# EAGLE design MKR-I2C-shield (EAGLE 9.2.2)
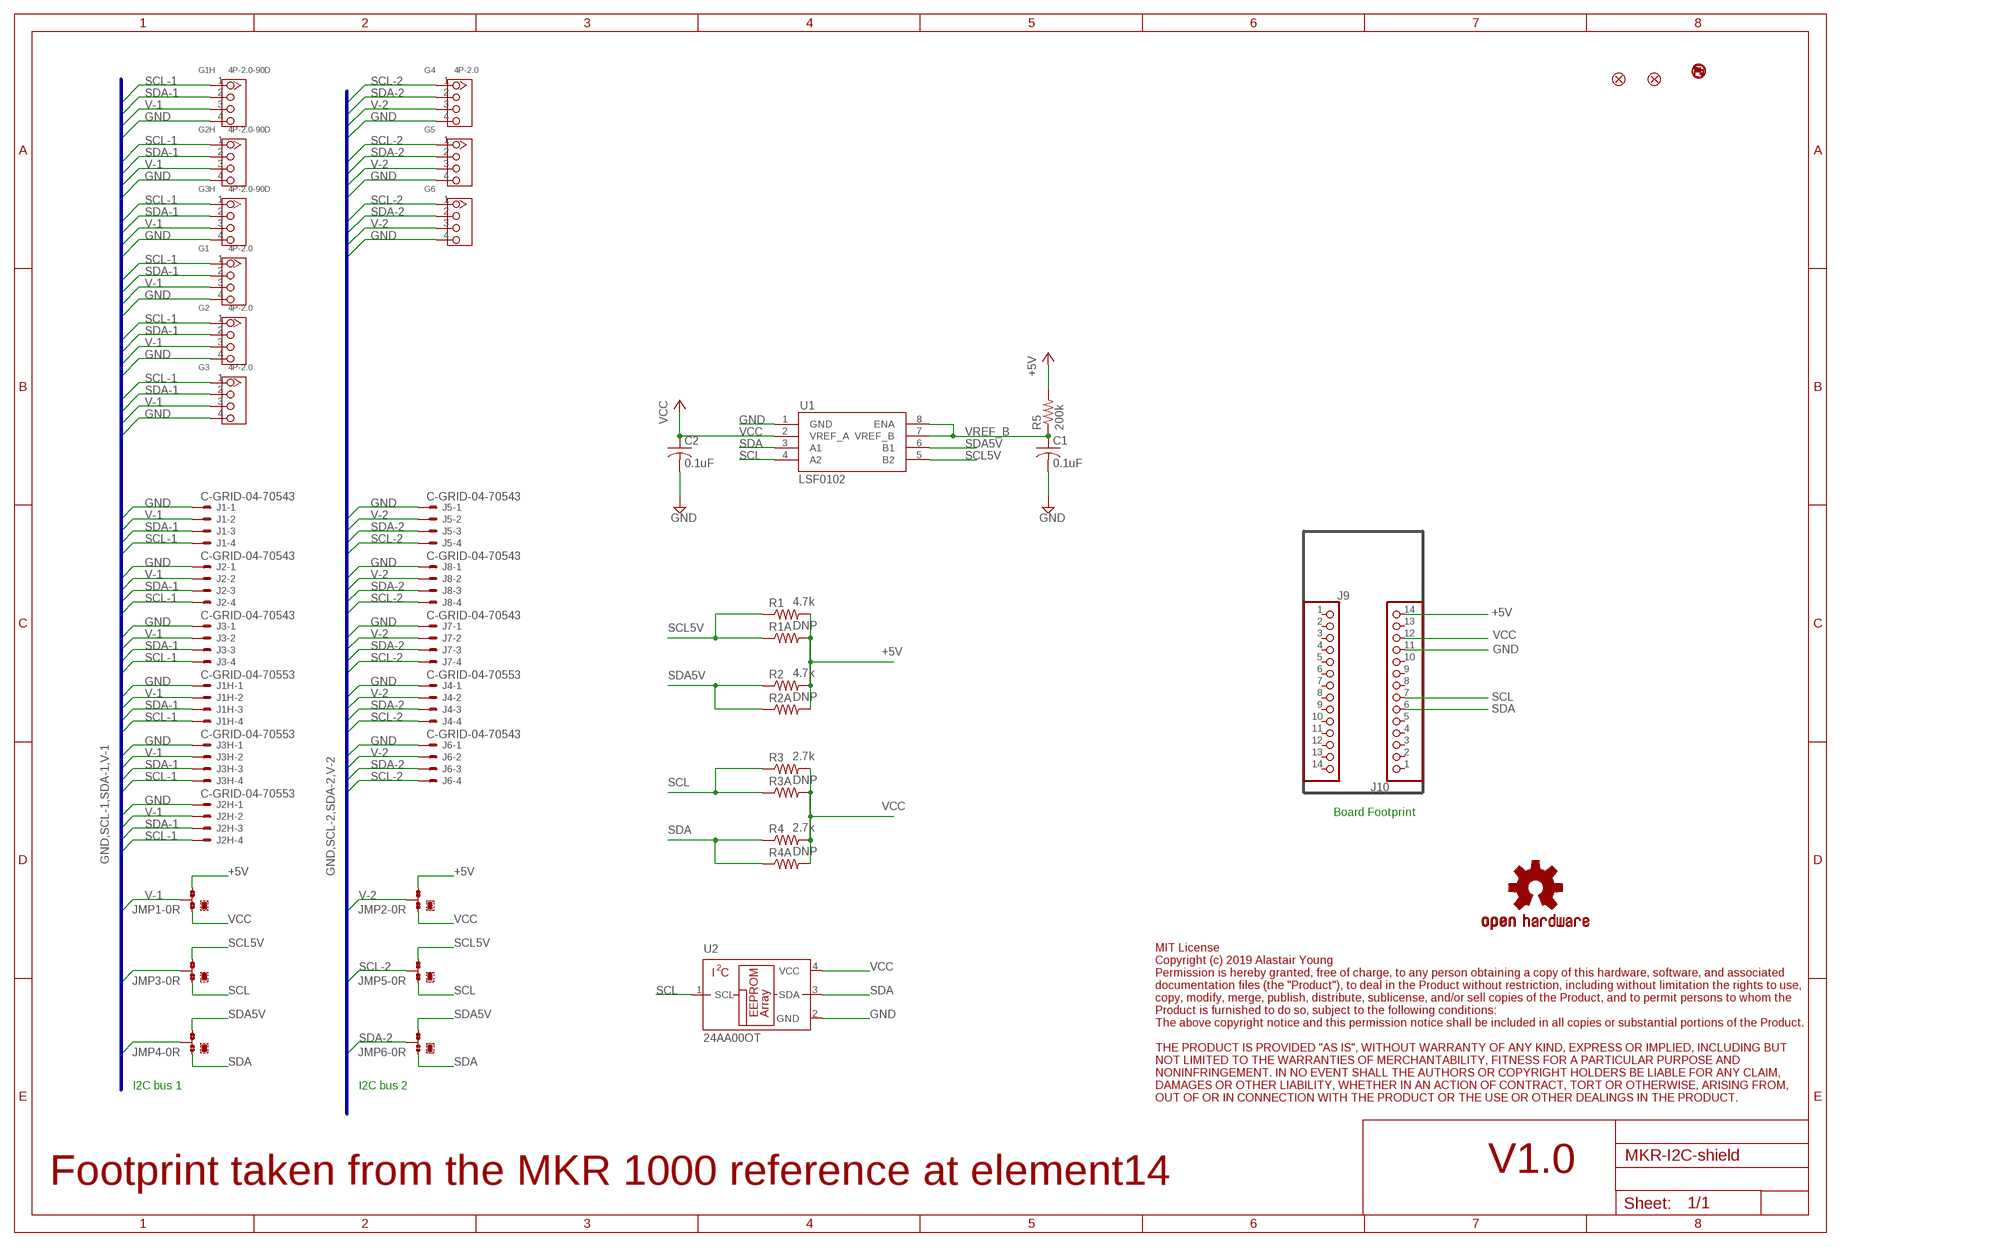
[diagram p0: schematic, sheet 1]

## Parts
C1  0.1uF  C-USC0603  [C0603]
C2  0.1uF  C-USC0603  [C0603]
FD1  FIDUCIAL1X2  [FIDUCIAL-1X2]
FD2  FIDUCIAL1X2  [FIDUCIAL-1X2]
G1  4P-2.0  GROVE-CONNECTOR-DIP(4P-2.0)  [HW4-2.0]
G1H  4P-2.0-90D  GROVE-CONNECTOR-DIP-90D(4P-2.0)  [HW4-2.0-90D]
G2  4P-2.0  GROVE-CONNECTOR-DIP(4P-2.0)  [HW4-2.0]
G2H  4P-2.0-90D  GROVE-CONNECTOR-DIP-90D(4P-2.0)  [HW4-2.0-90D]
G3  4P-2.0  GROVE-CONNECTOR-DIP(4P-2.0)  [HW4-2.0]
G3H  4P-2.0-90D  GROVE-CONNECTOR-DIP-90D(4P-2.0)  [HW4-2.0-90D]
G4  4P-2.0  GROVE-CONNECTOR-DIP(4P-2.0)  [HW4-2.0]
G5  4P-2.0  GROVE-CONNECTOR-DIP(4P-2.0)  [HW4-2.0]
G6  4P-2.0  GROVE-CONNECTOR-DIP(4P-2.0)  [HW4-2.0]
J1  C-GRID-04-70543  [70543-04]
J1H  C-GRID-04-70553  [70553-04]
J2  C-GRID-04-70543  [70543-04]
J2H  C-GRID-04-70553  [70553-04]
J3  C-GRID-04-70543  [70543-04]
J3H  C-GRID-04-70553  [70553-04]
J4  C-GRID-04-70553  [70553-04]
J5  C-GRID-04-70543  [70543-04]
J6  C-GRID-04-70543  [70543-04]
J7  C-GRID-04-70543  [70543-04]
J8  C-GRID-04-70543  [70543-04]
J9  DNP  PINHD-1X14  [1X14]
J10  DNP  PINHD-1X14  [1X14]
JMP1  0R-JUMPB  [B0R-JMP]
JMP2  0R-JUMPB  [B0R-JMP]
JMP3  0R-JUMPB  [B0R-JMP]
JMP4  0R-JUMPB  [B0R-JMP]
JMP5  0R-JUMPB  [B0R-JMP]
JMP6  0R-JUMPB  [B0R-JMP]
LOGO1  OSHW-LOGOL  [OSHW-LOGO-L]
LOGO2  NO_PB_LOGO  [NO_PB_LOGO_0.120]
R1  4.7k  R-US_R0603  [R0603]
R1A  DNP  R-US_0204/5  [0204/5]
R2  4.7k  R-US_R0603  [R0603]
R2A  DNP  R-US_0204/5  [0204/5]
R3  2.7k  R-US_R0603  [R0603]
R3A  DNP  R-US_0204/5  [0204/5]
R4  2.7k  R-US_R0603  [R0603]
R4A  DNP  R-US_0204/5  [0204/5]
R5  200k  R-US_R0603  [R0603]
U1  LSF0102  [DCT_R-PDSO-G8]
U2  24AA00OT  [SOT23-5L]

## Nets
+5V: J10.14 JMP1.3 JMP2.3 R1.2 R1A.2 R2.2 R2A.2 R5.2
GND: C1.2 C2.2 G1.4 G1H.4 G2.4 G2H.4 G3.4 G3H.4 G4.4 G5.4 G6.4 J1.1 J1H.1 J2.1 J2H.1 J3.1 J3H.1 J4.1 J5.1 J6.1 J7.1 J8.1 J10.11 U1.1(GND) U2.2(GND)
SCL: J10.7 JMP3.1 JMP5.1 R3.1 R3A.1 U1.4(A2) U2.1(SCL)
SCL5V: JMP3.3 JMP5.3 R1.1 R1A.1 U1.5(B2)
SCL-1: G1.1 G1H.1 G2.1 G2H.1 G3.1 G3H.1 J1.4 J1H.4 J2.4 J2H.4 J3.4 J3H.4 JMP3.2
SCL-2: G4.1 G5.1 G6.1 J4.4 J5.4 J6.4 J7.4 J8.4 JMP5.2
SDA: J10.6 JMP4.1 JMP6.1 R4.1 R4A.1 U1.3(A1) U2.3(SDA)
SDA5V: JMP4.3 JMP6.3 R2.1 R2A.1 U1.6(B1)
SDA-1: G1.2 G1H.2 G2.2 G2H.2 G3.2 G3H.2 J1.3 J1H.3 J2.3 J2H.3 J3.3 J3H.3 JMP4.2
SDA-2: G4.2 G5.2 G6.2 J4.3 J5.3 J6.3 J7.3 J8.3 JMP6.2
V-1: G1.3 G1H.3 G2.3 G2H.3 G3.3 G3H.3 J1.2 J1H.2 J2.2 J2H.2 J3.2 J3H.2 JMP1.2
V-2: G4.3 G5.3 G6.3 J4.2 J5.2 J6.2 J7.2 J8.2 JMP2.2
VCC: C2.1 J10.12 JMP1.1 JMP2.1 R3.2 R3A.2 R4.2 R4A.2 U1.2(VREF_A) U2.4(VCC)
VREF_B: C1.1 R5.1 U1.7(VREF_B) U1.8(ENA)
Unconnected: J9.1 J9.2 J9.3 J9.4 J9.5 J9.6 J9.7 J9.8 J9.9 J9.10 J9.11 J9.12 J9.13 J9.14 J10.1 J10.2 J10.3 J10.4 J10.5 J10.8 J10.9 J10.10 J10.13

## Buses
GND,SCL-1,SDA-1,V-1
GND,SCL-2,SDA-2,V-2

## Notes on the sheet
- Board Footprint
- I2C bus 1 | I2C bus 2
- MIT License
  Copyright (c) 2019 Alastair Young
  Permission is hereby granted, free of charge, to any person obtaining a copy of this hardware, software, and associated
  documentation files (the "Product"), to deal in the Product without restriction, including without limitation the rights to use,
  copy, modify, merge, publish, distribute, sublicense, and/or sell copies of the Product, and to permit persons to whom the
  Product is furnished to do so, subject to the following conditions:
  The above copyright notice and this permission notice shall be included in all copies or substantial portions of the Product.
  
  THE PRODUCT IS PROVIDED "AS IS", WITHOUT WARRANTY OF ANY KIND, EXPRESS OR IMPLIED, INCLUDING BUT
  NOT LIMITED TO THE WARRANTIES OF MERCHANTABILITY, FITNESS FOR A PARTICULAR PURPOSE AND
  NONINFRINGEMENT. IN NO EVENT SHALL THE AUTHORS OR COPYRIGHT HOLDERS BE LIABLE FOR ANY CLAIM,
  DAMAGES OR OTHER LIABILITY, WHETHER IN AN ACTION OF CONTRACT, TORT OR OTHERWISE, ARISING FROM,
  OUT OF OR IN CONNECTION WITH THE PRODUCT OR THE USE OR OTHER DEALINGS IN THE PRODUCT.
- Footprint taken from the MKR 1000 reference at element14 | V1.0

## Library data of the parts
C1 C2 = rcl:C-US: CAPACITOR, American symbol; SPICEPREFIX: C
FD1 FD2 = SparkFun-Aesthetics:FIDUCIAL: Fiducial Alignment Points Point-of-reference for pick-and-place machines and other optical instruments.
G1-G6 = redhunter:GROVE-CONNECTOR-DIP(4P-2.0): 320110033
G1H G2H G3H = redhunter:GROVE-CONNECTOR-DIP-90D(4P-2.0): 320110034
J1 J1H J2 J2H J3 J3H J4-J8 = redhunter:C-GRID-04: CONNECTOR wire to board 2.54 mm (0.100") pitch header; MF: MOLEX; OC_FARNELL: unknown; OC_NEWARK: unknown
J9 J10 = adafruit:PINHD-1X14: PIN HEADER
JMP1-JMP6 = redhunter:0R-JUMP: SMD 0R 0805 Jumper
LOGO1 = SparkFun-Aesthetics:OSHW-LOGO: Open-Source Hardware (OSHW) Logo This logo indicates the piece of hardware it is found on incorporates a OSHW license and/or adheres to the definition of open source hardware found here: http://freedomdefined.org/OSHW
LOGO2 = SparkFun-Aesthetics:NO_PB_LOGO: Lead-Free (No Pb) Logo Logo for lead-safe certified hardware.
R1 R1A R2 R2A R3 R3A R4 R4A R5 = rcl:R-US_: RESISTOR, American symbol; SPICEPREFIX: R
U1 = redhunter:LSF0102
U2 = microchip:24*00: Serial EEPROM 128 bit, I2C (AA = 1.8 V/LC = 2.5 V/C = 5.0 V); MF: MICROCHIP; MPN: 24AA00T-I/OTG; OC_FARNELL: 1331264; OC_NEWARK: 89H3038

## Net classes
0 default: width 0.203 mm, drill 0.33 mm, clearance 0.203 mm
1 power: width 0.254 mm, drill 0.406 mm, clearance 0.254 mm

## Board
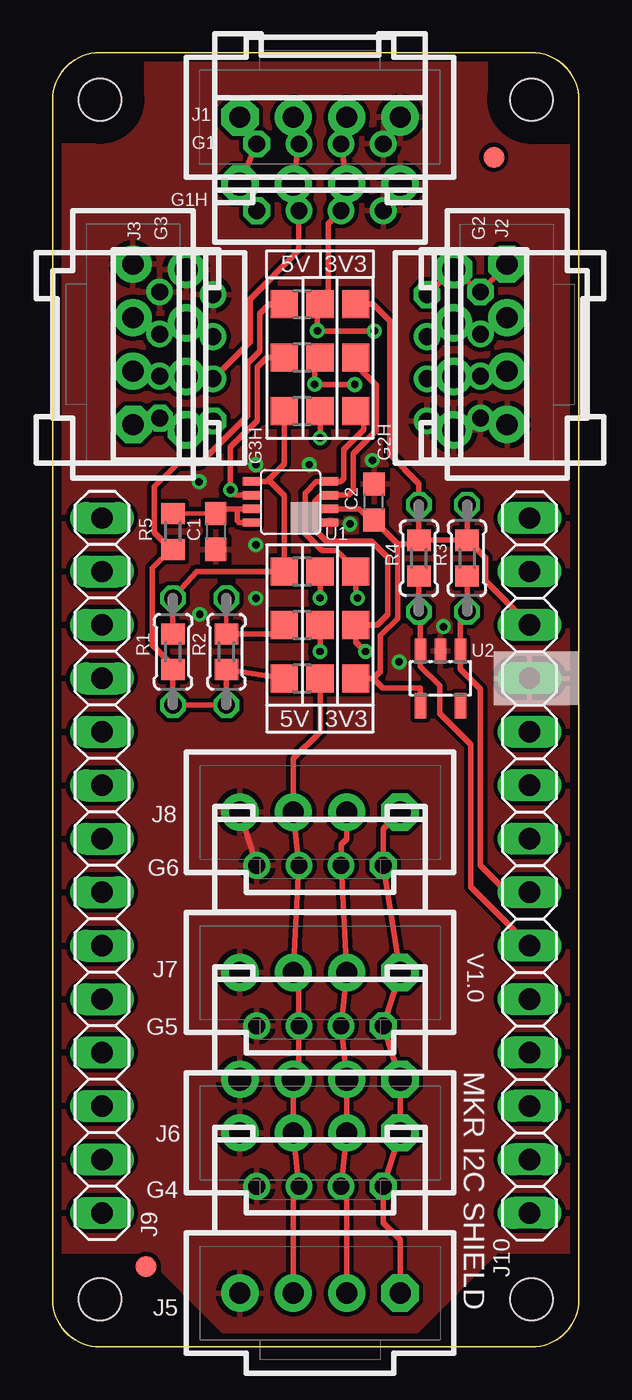
[diagram p1: board, top side]
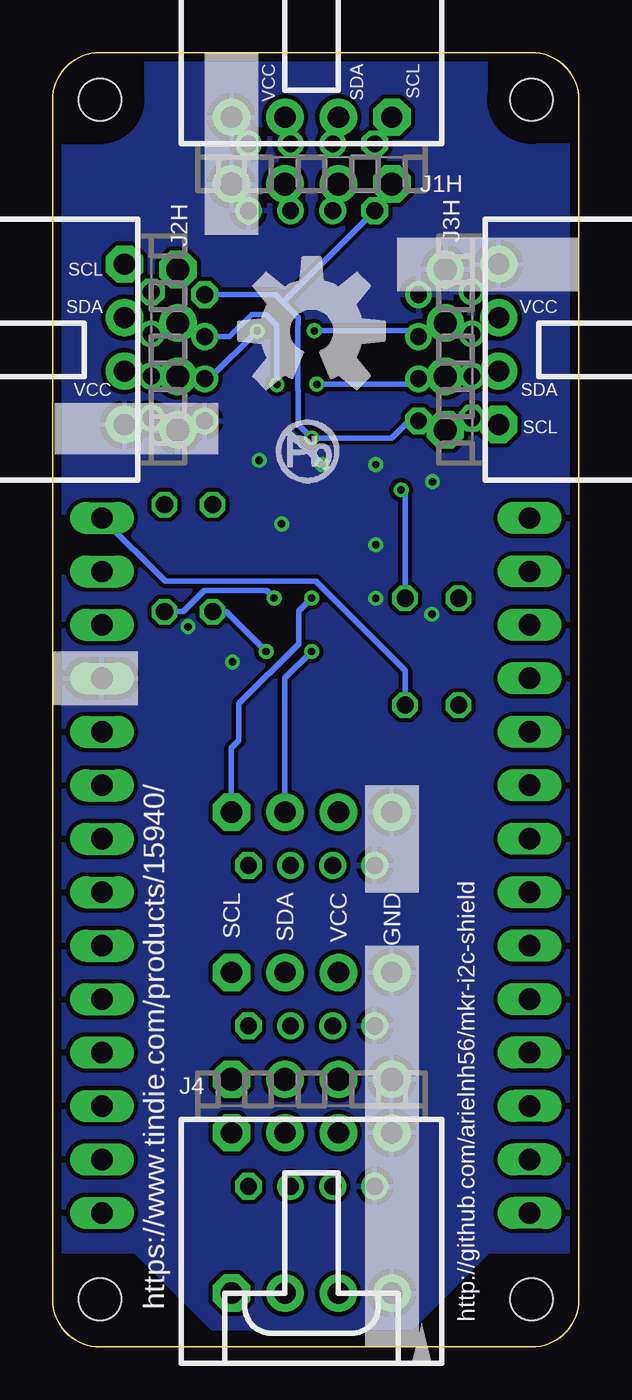
[diagram p2: board, bottom side, seen from below]

Size 25 x 61.5 mm. Coordinates in mm from the lower left corner, seen from the top.
Outline: 0,2.25 0,59.25 arc-90 2.25,61.5 22.75,61.5 arc-90 25,59.25 25,2.25 arc-90 22.75,0 2.25,0 arc-90 0,2.25
Copper layers (1*16): Top 0.0356mm / dielectric 1.5011mm / Bottom 0.0356mm
Design rules "mypcbway": minimum track width 6mil, minimum drill 13mil, track to track 6mil, track to pad 6mil, pad to pad 6mil, via to via 6mil, smd to smd 6mil, copper to edge 15mil, drill to drill 6mil, minimum pad ring 7mil, minimum via ring 7mil, stop-mask expansion 2.5mil, vias tented up to drill 24mil, thermal gap 10mil
Holes 2 mm at 2.25,59.26 22.75,59.26 22.75,2.26 2.25,2.26
tRestrict: area 0.3,57.3 to 4.2,61.2; area 20.8,57.3 to 24.7,61.2; 4 lines
bRestrict: area 0.3,57.3 to 4.2,61.2; area 20.8,57.3 to 24.7,61.2; 4 lines

### Footprints (pad centres in the part's own frame; a part is rotated, then mirrored left to right if it is on the bottom)
C0603 = smd 1.1 x 1: 1 -0.85,0; 2 0.85,0
FIDUCIAL-1X2 = smd 1 x 1: 1 0,0
HW4-2.0 = drill 0.8 pad 1.27 octagon: 1 -3,0 | drill 0.8 pad 1.27: 2 -1,0; 3 1,0; 4 3,0
HW4-2.0-90D = drill 0.8 pad 1.27 octagon: 1 -3,0 | drill 0.8 pad 1.27: 2 -1,0; 3 1,0; 4 3,0
70543-04 = drill 1.016 pad 1.778: 1 -3.81,0; 2 -1.27,0; 3 1.27,0 | drill 1.016 pad 1.778 octagon: 4 3.81,0
70553-04 = drill 1.092 pad 1.778: 1 -3.81,0; 2 -1.27,0; 3 1.27,0 | drill 1.092 pad 1.778 octagon: 4 3.81,0
1X14 = drill 1.016 long: 1 -16.51,0; 2 -13.97,0; 3 -11.43,0; 4 -8.89,0; 5 -6.35,0; 6 -3.81,0; 7 -1.27,0; 8 1.27,0; 9 3.81,0; 10 6.35,0; 11 8.89,0; 12 11.43,0; 13 13.97,0; 14 16.51,0
B0R-JMP = smd 1.321 x 1.3: 1 0,1.7; 2 0,0; 3 0,-1.7
R0603 = smd 1 x 1.1: 1 -0.85,0; 2 0.85,0
0204/5 = drill 0.813 octagon: 1 -2.54,0; 2 2.54,0
DCT_R-PDSO-G8 = smd 0.4 x 0.8: 1 -0.975,-1.875; 2 -0.325,-1.875; 3 0.325,-1.875; 4 0.975,-1.875; 5 0.975,1.875; 6 0.325,1.875; 7 -0.325,1.875; 8 -0.975,1.875
SOT23-5L = smd 0.55 x 1.2: 1 -0.95,-1.3; 2 0,-1.3; 3 0.95,-1.3; 4 0.95,1.3; 5 -0.95,1.3

### Placement (x,y rotation side)
C1  7.75,38.75 270 top
C2  15.27,40.14 90 top
FD1  4.45,3.82 0 top
FD2  20.95,56.53 0 top
G1  12.7,57.16 0 top
G1H  12.7,53.99 0 top
G2  20.32,47.13 270 top
G2H  17.78,47 270 top
G3  5.08,47.13 90 top
G3H  7.62,47 90 top
G4  12.7,7.63 180 top
G5  12.7,15.25 180 top
G6  12.7,22.87 180 top
J1  12.7,58.43 180 top
J1H  12.7,55.26 0 bottom
J2  21.59,47.64 90 top
J2H  19.05,47.38 90 bottom
J3  3.81,47.64 270 top
J3H  6.35,47.38 270 bottom
J4  12.7,12.71 180 bottom
J5  12.7,2.55 0 top
J6  12.7,10.17 0 top
J7  12.7,17.79 0 top
J8  12.7,25.41 0 top
J9  2.34,22.87 270 top
J10  22.66,22.87 90 top
JMP1  12.7,49.54 270 top
JMP2  12.7,31.76 270 top
JMP3  12.7,44.46 270 top
JMP4  12.7,47 270 top
JMP5  12.7,36.84 270 top
JMP6  12.7,34.3 270 top
LOGO1  12.7,48.27 0 bottom
LOGO2  14.61,40.65 0 bottom
R1  5.71,33.03 270 top
R1A  5.71,33.03 270 top
R2  8.26,33.03 270 top
R2A  8.26,33.03 270 top
R3  19.68,37.48 90 top
R3A  19.68,37.48 90 top
R4  17.4,37.48 90 top
R4A  17.4,37.48 90 top
R5  5.71,38.75 270 top
U1  11.3,40.14 90 top
U2  18.41,31.76 180 top

### Tracks (layer width: path | path; a pad name or v marks a point on that pad's centre or on a via)
+5V
  Top 0.254: JMP2.3 R2.2 R2A.2 R1A.2 R1.2 5.71,32.37 4.72,33.36 4.72,37 5.62,37.9 R5.2 5.64,37.9 4.83,38.71 4.83,40.87 5.94,41.97 6.98,41.97 9.26,44.25 9.26,46.75 9.84,47.33 9.84,49.09 10.29,49.54 JMP1.3
  Bottom 0.254: R2A.2 8.26,32.14 12.5,36.38 19.66,36.38 J10.14
GND  (via drill 0.35)
  Top 0.254: G6.4 J8.1
  other vias: 9.65,35.57 6.99,34.81 14.12,39.1 15.19,42.13 9.65,38.11 18.57,34.23 12.19,41.92 9.65,41.92 6.96,41.11 16.46,32.55
  pour Bottom: -0.4,62.06 25.6,62.06 25.6,40.56 25.36,40.56 25.36,4.56 21.06,4.56 17.4,0.9 8,0.9 4.34,4.56 -0.4,4.56
  pour Top: -0.4,62.06 25.6,62.06 25.6,4.56 21.06,4.56 17.27,0.77 8.13,0.77 4.34,4.56 -0.4,4.56
SCL  (via drill 0.35)
  Top 0.254: R3.1 R3A.1 19.36,34.62 U2.1 19.36,32.21 20.32,31.25 20.32,22.87 21.59,21.6 J10.7 | v14.48,35.58 14.4,36.06 JMP5.1 14.4,36.92 13.49,37.83 12.8,37.83 11.99,38.64 11.99,40.58 12.53,41.12 U1.4 13.68,41.12 13.83,41.27 13.83,42.63 14.78,43.59 14.78,44.08 JMP3.1
  Bottom 0.254: R3A.1 18.8,34.94 17.81,35.93 14.82,35.93 v14.48,35.58
SCL5V
  Top 0.254: R1.1 R1A.1 6.85,36.84 JMP5.3 11,40.45 10.33,41.12 10.16,41.12 | 10.16,41.12 U1.5 | 10.16,41.12 11,41.96 JMP3.3
SCL-1  (via drill 0.35)
  Top 0.254: J2.4 G2.1 J2H.4 G2H.1 | J3.4 G3.1 J3H.4 G3H.1 | v12.7,43.19 JMP3.2 | J1.4 8.89,57.97 G1.1 J1H.4 8.89,54.8 G1H.1
  Bottom 0.254: G3H.1 8.08,44 8.89,43.19 v12.7,43.19 13.34,43.83 13.34,45.45 13.36,45.47 13.36,48.55 13.34,48.58 13.34,48.91 13.97,49.54 | G2H.1 14.43,50 13.97,49.54 | G1H.1 13.97,49.72 13.97,49.54
SCL-2  (via drill 0.35)
  Top 0.254: J5.4 16.51,5.09 15.7,5.9 G4.1 J6.4 J4.4 G5.1 J7.4 G6.1 15.7,24.6 J8.4 | JMP5.2 v12.7,35.58
  Bottom 0.254: J8.4 16.51,28.46 16.15,28.81 16.15,30.56 13.31,33.41 13.31,34.97 v12.7,35.58
SDA  (via drill 0.35)
  Top 0.254: R4.1 R4A.1 17.46,34.87 U2.3 17.46,32.33 18.38,31.42 18.38,30.11 19.86,28.62 19.86,21.86 J10.6 | v14.86,33.04 14.4,33.5 JMP6.1 15.42,34.3 15.93,34.81 15.93,37.5 15.14,38.29 12.99,38.29 12.45,38.83 12.45,40.16 12.76,40.47 U1.3 14.04,40.47 14.28,40.71 14.28,42.44 15.38,43.54 15.38,45.7 14.4,46.69 JMP4.1
  Bottom 0.254: v14.86,33.04 16.75,34.94 R4A.1
SDA5V  (via drill 0.35)
  Top 0.203: R2.1 R2A.1
  Top 0.254: JMP4.3 10.16,47 9.72,46.56 9.72,44.02 8.45,42.75 v8.45,40.73 8.71,40.47 U1.6 | R2.1 10.58,33.88 JMP6.3
  Bottom 0.254: R2A.1 8.26,40.54 v8.45,40.73
SDA-1  (via drill 0.35)
  Top 0.254: J2.3 G2.2 J2H.3 G2H.2 | J3.3 G3.2 J3H.3 G3H.2 9.38,47.76 9.38,49.79 11.7,52.11 G1H.2 J1H.3 G1.2 J1.3 | v14.35,45.73 v12.46,45.73 v12.45,45.74 12.45,47 JMP4.2
  Bottom 0.254: v12.45,45.74 7.88,45.74 G3H.2 | G2H.2 16.61,48 15.55,49.06 14.88,49.06 14.35,48.53 v14.35,45.73
SDA-2  (via drill 0.35)
  Top 0.254: G4.2 13.7,7.66 | 13.7,7.66 J6.3 J4.3 G5.2 J7.3 G6.2 13.7,23.87 13.97,24.14 J8.3 | 13.7,7.66 13.97,7.39 J5.3 | v12.7,33.04 JMP6.2
  Bottom 0.254: J8.3 13.97,31.77 v12.7,33.04
V-1  (via drill 0.35)
  Top 0.254: G2H.3 J2H.2 G2.3 21.35,46.13 J2.2 | G3H.3 J3H.2 G3.3 4.3,48.91 J3.2 | v15.28,48.27 12.58,48.27 v12.57,48.28 12.57,49.41 JMP1.2 13.08,49.92 13.08,53.37 G1H.3 J1H.2 G1.3 13.97,57.43 J1.2
  Bottom 0.254: G3H.3 7.9,48.28 v12.57,48.28 | v15.28,48.27 17.55,46 G2H.3
V-2
  Top 0.254: 11.7,7.66 J6.2 J4.2 11.7,12.98 G5.3 11.7,17.52 J7.2 G6.3 J8.2 11.43,27.95 12.7,29.22 JMP2.2 | 11.7,7.66 G4.3 | 11.7,7.66 11.43,7.39 J5.2
VCC
  Top 0.254: JMP1.1 15.24,49.54 16.02,48.77 16.02,45.91 16.02,45.9 16.02,45.72 16.02,42.42 17.4,41.03 R4A.2 R4.2 17.78,38.33 | 15.24,31.76 JMP2.1 | R3.2 17.78,38.33 | R3.2 19.72,38.33 20.57,37.49 20.57,36.4 J10.12 | R3A.2 R3.2 | U2.4 17.46,31.32 15.69,31.32 15.24,31.76 | 16.51,38.15 16.38,38.15 15.27,39.27 C2.1 15.1,39.29 14.57,39.82 U1.2 | 16.51,38.15 17.6,38.15 17.78,38.33 | 16.51,38.15 16.38,38.02 16.38,34.62 15.57,33.8 15.57,32.09 15.24,31.76
VREF_B
  Top 0.203: C1.1 7.62,39.6 R5.1
  Top 0.254: 7.62,39.6 7.84,39.82 8.76,39.82 | U1.7 8.76,39.82 | U1.8 8.85,39.17 8.76,39.26 8.76,39.82

### Text on the board
tPlace: 5V | 3V3 | 5V | 3V3 | V1.0 | MKR I2C SHIELD
bPlace: SCL | SDA | VCC | SCL | VCC | SDA | SDA | VCC | SCL | GND | VCC | SDA | SCL | https://www.tindie.com/products/15940/ | http://github.com/arielnh56/mkr-i2c-shield